# Altium schematic sheet Pop.SchDoc
size A3
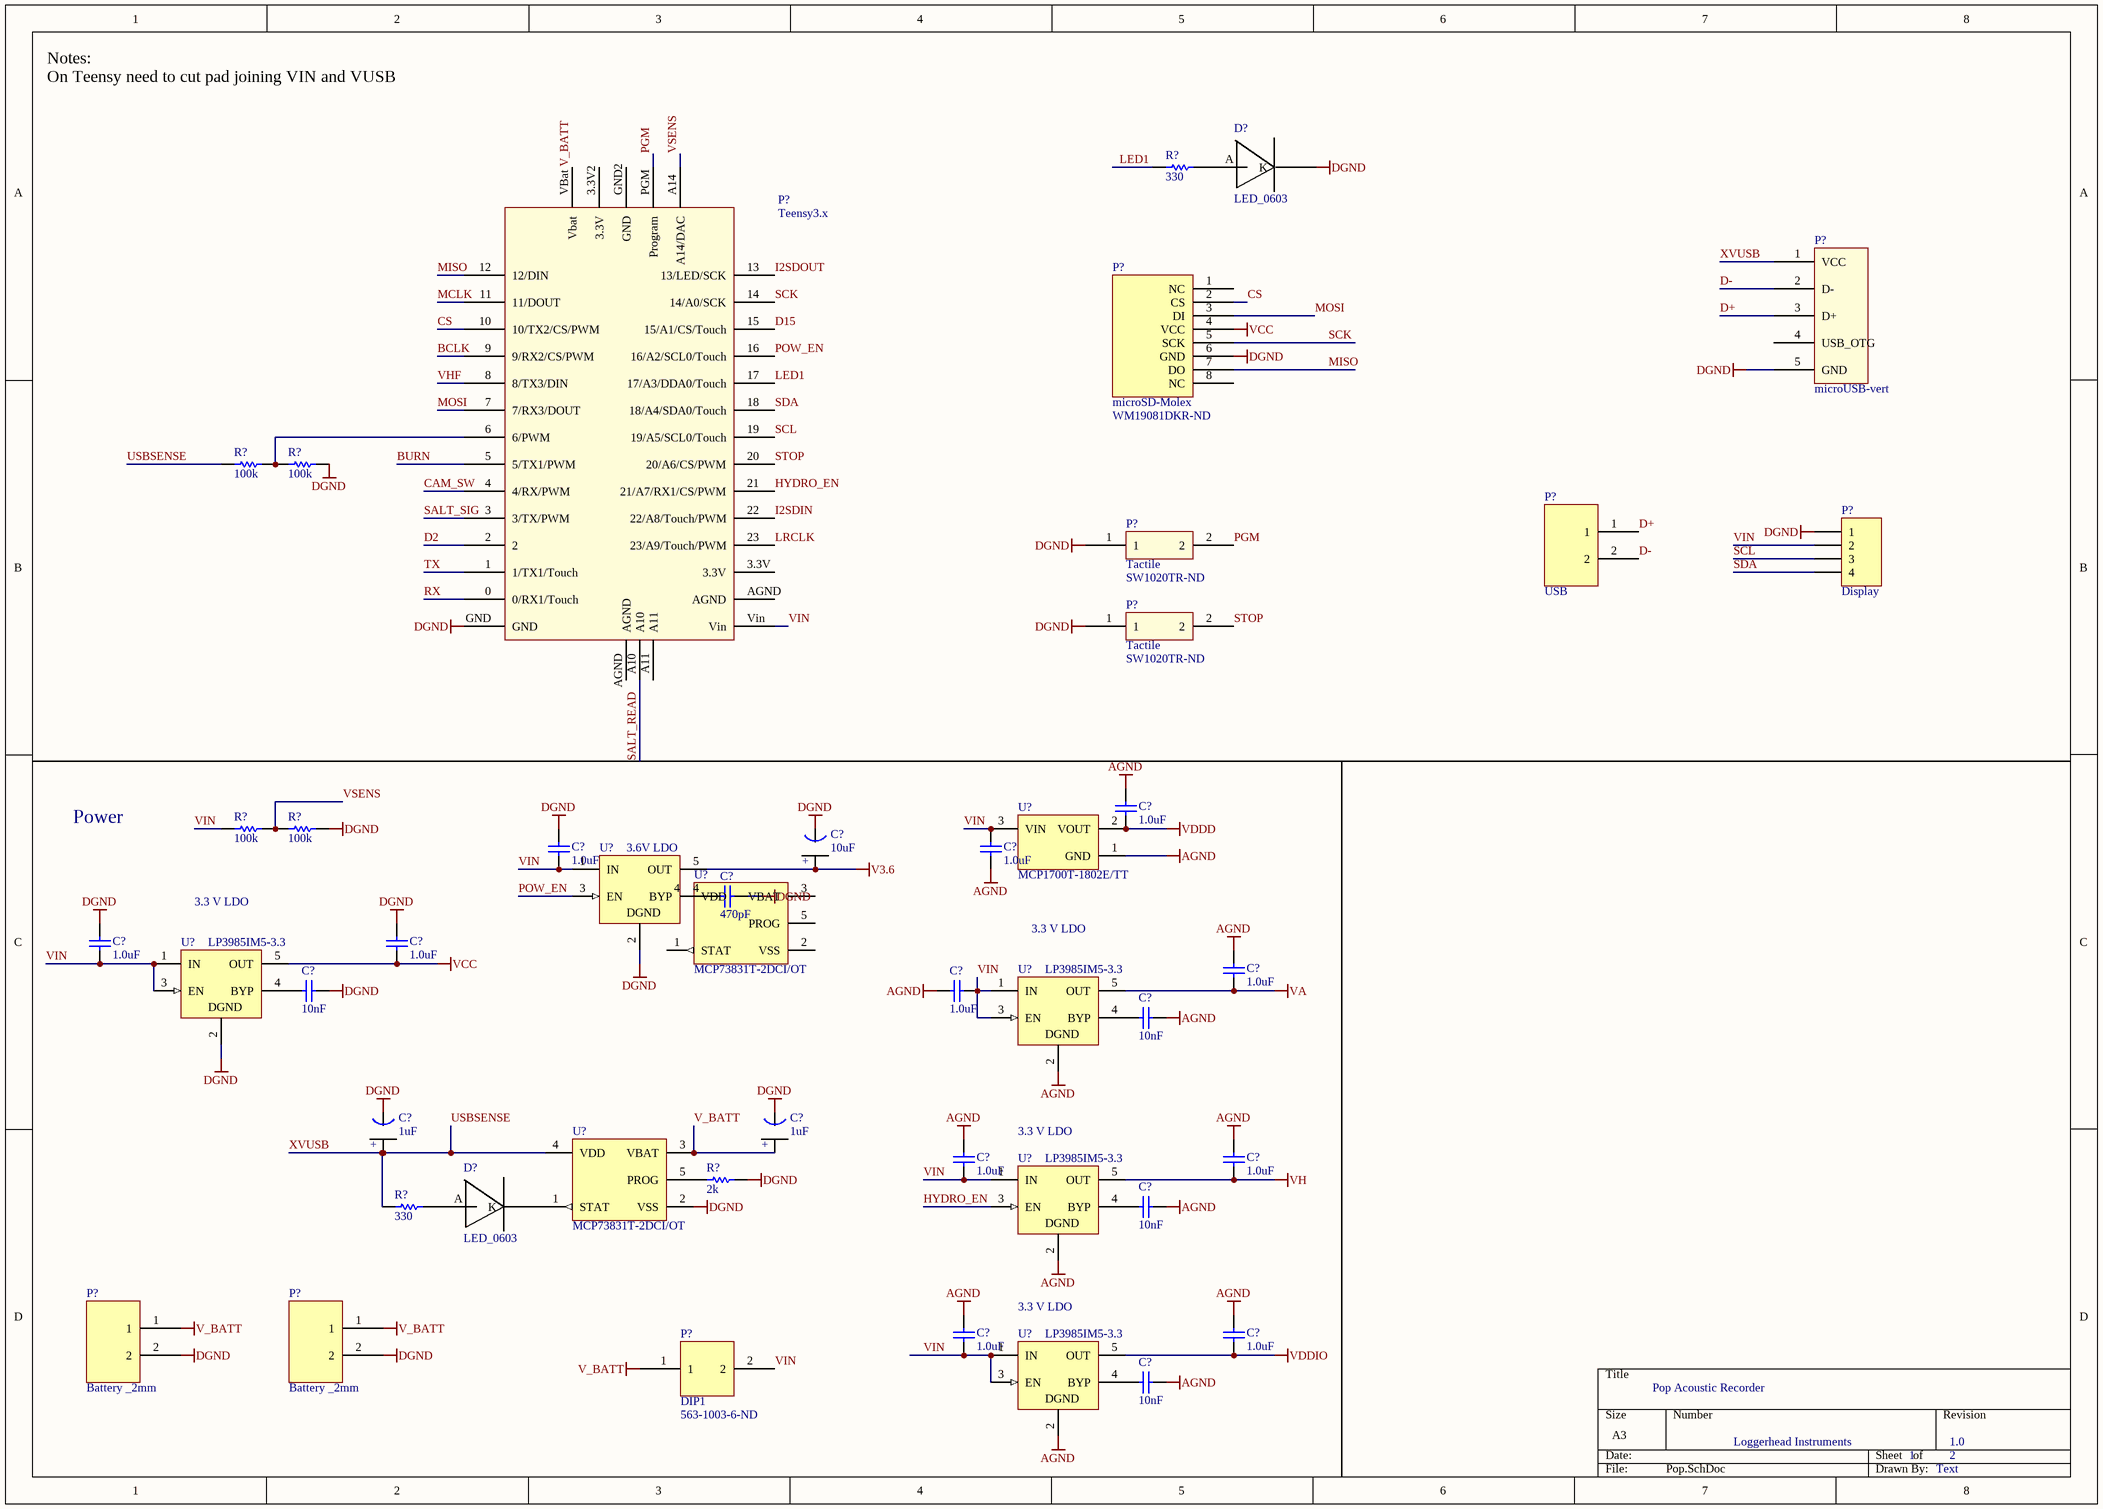
[diagram p0: Pop.SchDoc]

## Parts
(Parts that share a designator on the sheet are numbered #1, #2 ... from top to bottom, then left to right.)
C?#1  1.0uF  [0402]
C?#2  1.0uF  [0402]
C?#3  1.0uF  [0402]
C?#4  10uF  [Tant0805]
C?#5  470pF  [0402]
C?#6  1.0uF  [0402]
C?#7  1.0uF  [0402]
C?#8  1.0uF  [0402]
C?#9  10nF  [0402]
C?#10  1.0uF  [0402]
C?#11  10nF  [0402]
C?#12  1uF  [Tant0805]
C?#13  1uF  [Tant0805]
C?#14  1.0uF  [0402]
C?#15  1.0uF  [0402]
C?#16  10nF  [0402]
C?#17  1.0uF  [0402]
C?#18  1.0uF  [0402]
C?#19  10nF  [0402]
D?#1  LED_0603  [Diode0603]
D?#2  LED_0603  [Diode0603]
P?#1  microUSB-vert  [MICROUSB-VERT]
P?#2  microSD-Molex  Supplier Part Number 1: WM19081DKR-ND  [microSD_Molex_hinged]
P?#3  Teensy3.x  [Teensy3.x]
P?#4  Display  [HDR1X4]
P?#5  Tactile  Supplier Part Number 1: SW1020TR-ND  [Tactile-B3U-1000]
P?#6  USB  [HDR_2x1_2mm]
P?#7  Tactile  Supplier Part Number 1: SW1020TR-ND  [Tactile-B3U-1000]
P?#8  Battery _2mm  [HDR_2x1_2mm]
P?#9  Battery _2mm  [HDR_2x1_2mm]
P?#10  DIP1  Supplier Part Number 1: 563-1003-6-ND  [DIP1]
R?#1  330  [3-0603]
R?#2  100k  [3-0603]
R?#3  100k  [3-0603]
R?#4  100k  [3-0603]
R?#5  100k  [3-0603]
R?#6  330  [3-0603]
R?#7  2k  [3-0603]
U?#1  MCP1700T-1802E/TT  [SOT-23-TT3_N]
U?#2  3.6V LDO  [MF05A_N]
U?#3  MCP73831T-2DCI/OT  [SOT-23-OT5_N]
U?#4  LP3985IM5-3.3  [MF05A_N]
U?#5  LP3985IM5-3.3  [MF05A_N]
U?#6  MCP73831T-2DCI/OT  [SOT-23-OT5_N]
U?#7  LP3985IM5-3.3  [MF05A_N]
U?#8  LP3985IM5-3.3  [MF05A_N]

## Nets
AGND: C?#1.2 C?#2.2 C?#8.2 C?#10.2 C?#11.1 C?#14.2 C?#15.2 C?#16.1 C?#17.2 C?#18.2 C?#19.1 U?#1.1(GND) U?#5.2(GND) U?#7.2(GND) U?#8.2(GND)
DGND: C?#3.2 C?#4.1(GND) C?#5.1 C?#6.2 C?#7.2 C?#9.1 C?#12.1(GND) C?#13.1(GND) D?#1.K P?#1.5(GND) P?#2.6(GND) P?#3.GND P?#4.1 P?#5.1 P?#7.1 P?#8.2 P?#9.2 R?#3.2 R?#5.1 R?#7.1 U?#2.2(GND) U?#4.2(GND) U?#6.2(VSS)
V3.6: C?#4.2(+) U?#2.5(OUT)
V_BATT: C?#13.2(+) P?#3.VBat(Vbat) P?#8.1 P?#9.1 P?#10.1 U?#6.3(VBAT)
VA: C?#8.1 U?#5.5(OUT)
VCC: C?#7.1 P?#2.4(VCC) U?#4.5(OUT)
VDDD: C?#1.1 U?#1.2(VOUT)
VDDIO: C?#18.1 U?#8.5(OUT)
VH: C?#15.1 U?#7.5(OUT)
BCLK: P?#3.9(9/RX2/CS/PWM)
BURN: P?#3.5(5/TX1/PWM)
CAM_SW: P?#3.4(4/RX/PWM)
CS: P?#2.2(CS) P?#3.10(10/TX2/CS/PWM)
D2: P?#3.2
D15: P?#3.15(15/A1/CS/Touch)
D+: P?#1.3(D+) P?#6.1
D-: P?#1.2(D-) P?#6.2
HYDRO_EN: P?#3.21(21/A7/RX1/CS/PWM) U?#7.3(EN)
I2SDIN: P?#3.22(22/A8/Touch/PWM)
I2SDOUT: P?#3.13(13/LED/SCK)
LED1: P?#3.17(17/A3/DDA0/Touch) R?#1.1
LRCLK: P?#3.23(23/A9/Touch/PWM)
MCLK: P?#3.11(11/DOUT)
MISO: P?#2.7(DO) P?#3.12(12/DIN)
MOSI: P?#2.3(DI) P?#3.7(7/RX3/DOUT)
PGM: P?#3.PGM(Program) P?#5.2
POW_EN: P?#3.16(16/A2/SCL0/Touch) U?#2.3(EN)
RX: P?#3.0(0/RX1/Touch)
SALT_READ: P?#3.A10
SALT_SIG: P?#3.3(3/TX/PWM)
SCK: P?#2.5(SCK) P?#3.14(14/A0/SCK)
SCL: P?#3.19(19/A5/SCL0/Touch) P?#4.3
SDA: P?#3.18(18/A4/SDA0/Touch) P?#4.4
STOP: P?#3.20(20/A6/CS/PWM) P?#7.2
TX: P?#3.1(1/TX1/Touch)
USBSENSE: C?#12.2(+) P?#1.1(VCC) R?#2.1 R?#6.1 U?#6.4(VDD)  [also labelled XVUSB]
VHF: P?#3.8(8/TX3/DIN)
VIN: C?#2.1 C?#3.1 C?#6.1 C?#10.1 C?#14.1 C?#17.1 P?#3.Vin P?#4.2 P?#10.2 R?#4.2 U?#1.3(VIN) U?#2.1(IN) U?#4.1(IN) U?#4.3(EN) U?#5.1(IN) U?#5.3(EN) U?#7.1(IN) U?#8.1(IN) U?#8.3(EN)
VSENS: P?#3.A14(A14/DAC) R?#4.1 R?#5.2
NetC?#5_2: C?#5.2 U?#2.4(BYP)
NetC?#9_2: C?#9.2 U?#4.4(BYP)
NetC?#11_2: C?#11.2 U?#5.4(BYP)
NetC?#16_2: C?#16.2 U?#7.4(BYP)
NetC?#19_2: C?#19.2 U?#8.4(BYP)
NetD?#1_A: D?#1.A R?#1.2
NetD?#2_A: D?#2.A R?#6.2
NetD?#2_K: D?#2.K U?#6.1(STAT)
NetP?#3_6: P?#3.6(6/PWM) R?#2.2 R?#3.1
NetR?#7_2: R?#7.2 U?#6.5(PROG)

Not connected (* = marked no-connect by the designer): P?#1 4(USB_OTG); P?#2 1(NC) 8(NC); P?#3 3.3V 3.3V2(3.3V) A11 AGND GND2(GND); U?#3 1(STAT) 2(VSS) 3(VBAT) 4(VDD) 5(PROG)

## Notes on the sheet
- Notes:
  On Teensy need to cut pad joining VIN and VUSB
- Power
- 3.3 V LDO
- Pop Acoustic Recorder
- Loggerhead Instruments
- 1
- 1.0
- 2
- Text
- (in symbol LP3985IM5-3.3) DGND

## Library data of the parts
C?#1-C?#3 C?#5-C?#11 C?#14-C?#19 = C0402: Ceramic Chip Capacitor - Standard; Note: Footprint corresponds to dimensions for bulk cassette packaging. This case size has tightened tolerances.; Value: 0.1uF; Published: 17-Jul-2002; LatestRevisionDate: 19-Mar-2004; LatestRevisionNote: Silkscreen size reduced.; DatasheetDocument: Mar-2001; PackageDocument: Mar-2001; PackageReference: 0402; Publisher: Altium Limited; Code_JEITA: 0402; Code_IPC: 1005 [0402]; ComponentLink1Description: Manufacturer Link; ComponentLink1URL: http://www.kemet.com/; ComponentLink2Description: Datasheet; ComponentLink2URL: http://www.kemet.com/kemet/web/homepage/kechome.nsf/vapubfilesname/F3102TA.pdf/$file/F3102TA.pdf
C?#4 = Tant0805: Value: 1uF
C?#12 C?#13 = Tant0805: Value: 1uF
P?#1 = microUSB-vert: Molex 105133-0011
P?#2 = microSD_Molex_hinged: Supplier 1: Digi-Key
P?#4 = Header 4: Header, 4-Pin; LatestRevisionDate: 17-Jul-2002; LatestRevisionNote: Re-released for DXP Platform.; Publisher: Altium Limited
P?#5 P?#7 = Tactile_B3U-1000: Supplier 1: Digi-Key
P?#6 P?#8 P?#9 = HDR_2x1_2mm: Charging Connector
R?#1-R?#7 = ERJ3RK: Precision Thick Film Chip Resistor, 10 Ohm to 1M Ohm Range, 1% and 0.5% Tolerance, 0603 Size, 0.063 W; Published: 17-Dec-2003; LatestRevisionDate: 19-Mar-2004; LatestRevisionNote: Silkscreen size reduced.; PackageDocument: Mar-2003; PackageReference: 3-0603; Publisher: Altium Limited; Code_IPC: 1608 [0603]; ComponentLink1Description: Manufacturer Link; ComponentLink1URL: http://www.panasonic.com/industrial/components/resistive_products.htm; ComponentLink2Description: Datasheet; ComponentLink2URL: http://www.panasonic.com/industrial/components/pdf/AOA0000CE2.pdf
U?#1 = MCP1700T-1802E/TT: Low Quiescent Current LDO, 3-Pin SOT-23, Extended Temperature, Tape and Reel; Manufacturer: Microchip; DatasheetVersion: revB, Feb-2007; PackageVersion: revBB, Aug-2009; PackageReference: SOT-23-TT3; PackageDescription: 3-Lead Plastic Small Outline Transistor (TT) [SOT-23]; Supplier 1: Digi-Key; Supplier Part Number 1: MCP1700T1802ETTTR-ND; Supplier 2: Digi-Key; Supplier Part Number 2: MCP1700T1802ETTCT-ND; Supplier 3: Digi-Key; Supplier Part Number 3: MCP1700T1802ETTDKR-ND; Supplier 4: Farnell; Supplier Part Number 4: 1296591RL; Supplier 5: Farnell; Supplier Part Number 5: 1296591; Supplier 6: Newark; Supplier Part Number 6: 84R5175; Supplier 7: Mouser; Supplier Part Number 7: 579-MCP1700T1802E/TT; Mounting Technology: Surface Mount; Code_IPC: SOT23-3; PartNumber: MCP1700T-1802E/TT; ComponentLink1Description: Manufacturer URL; ComponentLink1URL: http://www.microchip.com/; ComponentLink2Description: Datasheet; ComponentLink2URL: http://ww1.microchip.com/downloads/en/DeviceDoc/21826b.pdf; ComponentLink3Description: Package Specification; ComponentLink3URL: http://www.microchip.com/stellent/groups/techpub_sg/documents/packagingspec/en012702.pdf
U?#2 U?#4 U?#5 U?#7 U?#8 = LP3985IM5-3.3: Micropower, 150mA Low-Noise Ultra Low-Dropout CMOS Voltage Regulator; Manufacturer: National Semiconductor; CompType: LDO IC; PackageTopMarking: LDQB*XTT; PowerWise: N; Published: 4-Dec-2008; DatasheetVersion: Aug-2005; PackageVersion: revD, Aug-2008; PackageReference: MF05A; Publisher: Altium Limited; PackageDescription: Molded SOT-23, .115 x .063 x .040 in Body, 5 Lead, .0375 in Pitch; PartNumber: LP3985IM5-3.3; RoHS: O; PinCount: 5; DigiKeyPartNumber: LP3985IM5-3.3CT-ND; ComponentLink1Description: LP3985 Datasheet; ComponentLink1URL: http://www.national.com/ds/LP/LP3985.pdf; ComponentLink2Description: LP3985 Web Page; ComponentLink2URL: http://www.national.com/pf/LP/LP3985.html; ComponentLink3Description: MF05A Package Page; ComponentLink3URL: http://www.national.com/packaging/folders/mf05a.html
U?#3 U?#6 = MCP73831T-2DCI/OT: Miniature Single-Cell, Fully Integrated Li-Ion, Li-Polymer Charge Management Controller, 4.2V, 5-Pin SOT-23, Industrial Temperature, Tape and Reel; DatasheetVersion: revE, Sep-2008; PackageVersion: revBB, Aug-2009; PackageReference: SOT-23-OT5; PackageDescription: 5-Lead Plastic Small Outline Transistor (OT) [SOT-23]; Code_IPC: SOT23-5; ComponentLink1Description: Manufacturer URL; ComponentLink1URL: http://www.microchip.com/; ComponentLink2Description: Datasheet; ComponentLink2URL: http://ww1.microchip.com/downloads/en/DeviceDoc/21984e.pdf; ComponentLink3Description: Package Specification; ComponentLink3URL: http://www.microchip.com/stellent/groups/techpub_sg/documents/packagingspec/en012702.pdf
P?#10 = DIP1: Supplier 1: Digi-Key